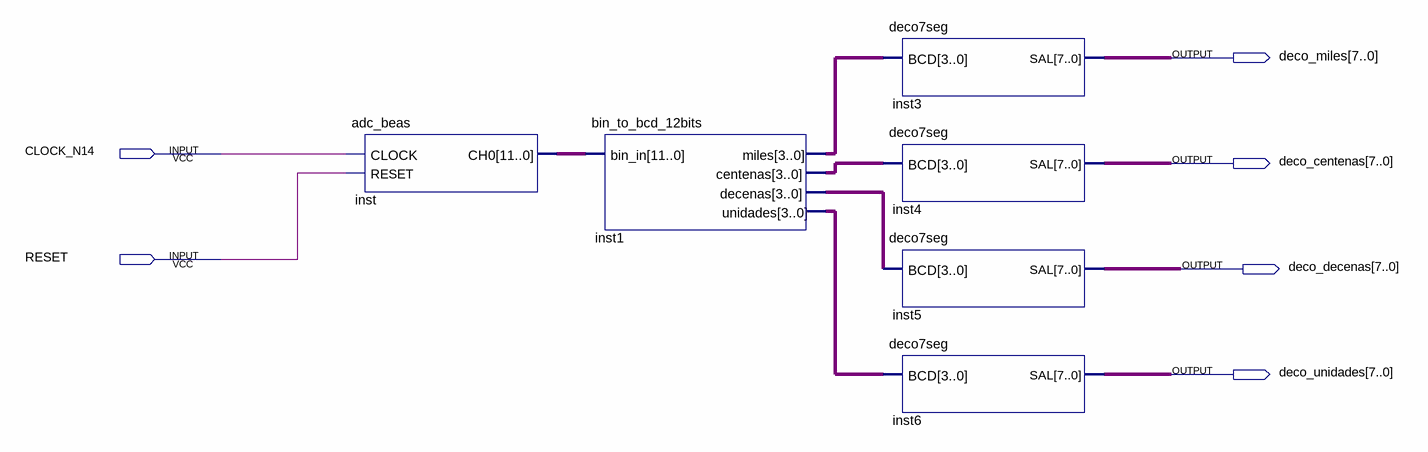
[diagram p0: schematic sheet]
// Quartus schematic main.bdf as structural Verilog: 6 symbols, 6 pins
module main (
  input  CLOCK_N14,
  input  RESET,
  output [7:0] deco_miles,
  output [7:0] deco_centenas,
  output [7:0] deco_decenas,
  output [7:0] deco_unidades
);

  wire [3:0] inst1_centenas, inst1_decenas, inst1_miles, inst1_unidades;
  wire [11:0] inst_ch0;

  adc_beas inst (.CLOCK(CLOCK_N14), .RESET(RESET), .CH0(inst_ch0));
  bin_to_bcd_12bits inst1 (
    .bin_in(inst_ch0), .miles(inst1_miles), .centenas(inst1_centenas), .decenas(inst1_decenas),
    .unidades(inst1_unidades));
  deco7seg inst3 (.BCD(inst1_miles), .SAL(deco_miles));
  deco7seg inst4 (.BCD(inst1_centenas), .SAL(deco_centenas));
  deco7seg inst5 (.BCD(inst1_decenas), .SAL(deco_decenas));
  deco7seg inst6 (.BCD(inst1_unidades), .SAL(deco_unidades));
endmodule
